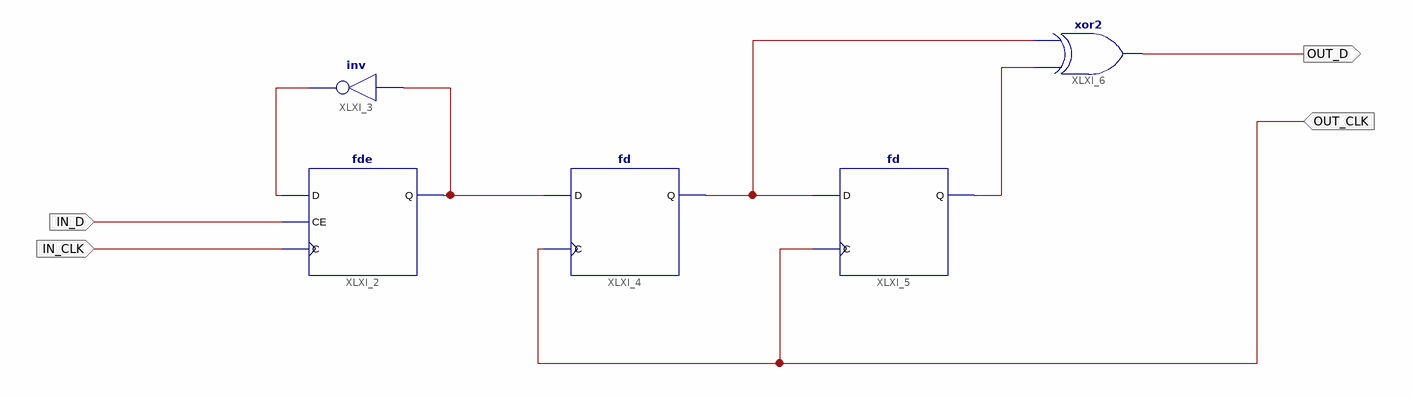
[diagram p0: schematic sheet 1]
// Xilinx ISE schematic trigger.sch (spartan3a) as structural Verilog: 5 symbols, 4 ports
module trigger (
  input  IN_D,
  input  IN_CLK,
  input  OUT_CLK,
  output OUT_D
);

  wire XLXN_1, XLXN_2, XLXN_9, XLXN_10;

  fde XLXI_2 (.C(IN_CLK), .CE(IN_D), .D(XLXN_2), .Q(XLXN_1));
  not XLXI_3 (XLXN_2, XLXN_1);
  fd XLXI_4 (.C(OUT_CLK), .D(XLXN_1), .Q(XLXN_10));
  fd XLXI_5 (.C(OUT_CLK), .D(XLXN_10), .Q(XLXN_9));
  xor XLXI_6 (OUT_D, XLXN_9, XLXN_10);
endmodule
